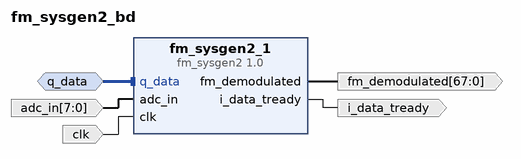
[diagram p0: block diagram of the top level]
# Vivado block design fm_sysgen2_bd, xc7s50csga324-2, Vivado 2018.3
create_bd_design fm_sysgen2_bd

create_bd_intf_port -mode Slave -vlnv xilinx.com:interface:axis_rtl:1.0 q_data
set_property -dict [list \
  CONFIG.HAS_TKEEP 0 \
  CONFIG.HAS_TLAST 0 \
  CONFIG.HAS_TREADY 1 \
  CONFIG.HAS_TSTRB 0 \
  CONFIG.LAYERED_METADATA undef \
  CONFIG.TDATA_NUM_BYTES 0 \
  CONFIG.TDEST_WIDTH 0 \
  CONFIG.TID_WIDTH 0 \
  CONFIG.TUSER_WIDTH 0 \
] [get_bd_intf_ports q_data]
create_bd_port -dir I -from 7 -to 0 -type data adc_in
create_bd_port -dir I -type clk clk
create_bd_port -dir O -from 67 -to 0 -type data fm_demodulated
create_bd_port -dir O -type data i_data_tready

create_bd_cell -type ip -vlnv User_Company:SysGen:fm_sysgen2:1.0 fm_sysgen2_1

# ---- connections ----

connect_bd_intf_net [get_bd_intf_ports q_data] [get_bd_intf_pins fm_sysgen2_1/q_data]
connect_bd_net [get_bd_ports adc_in] [get_bd_pins fm_sysgen2_1/adc_in]
connect_bd_net [get_bd_ports clk] [get_bd_pins fm_sysgen2_1/clk]
connect_bd_net [get_bd_pins fm_sysgen2_1/fm_demodulated] [get_bd_ports fm_demodulated]
connect_bd_net [get_bd_pins fm_sysgen2_1/i_data_tready] [get_bd_ports i_data_tready]

validate_bd_design
save_bd_design
